# EAGLE design SparkFun Uno Qwiic Mux Shield with JST (EAGLE 7.7.0)
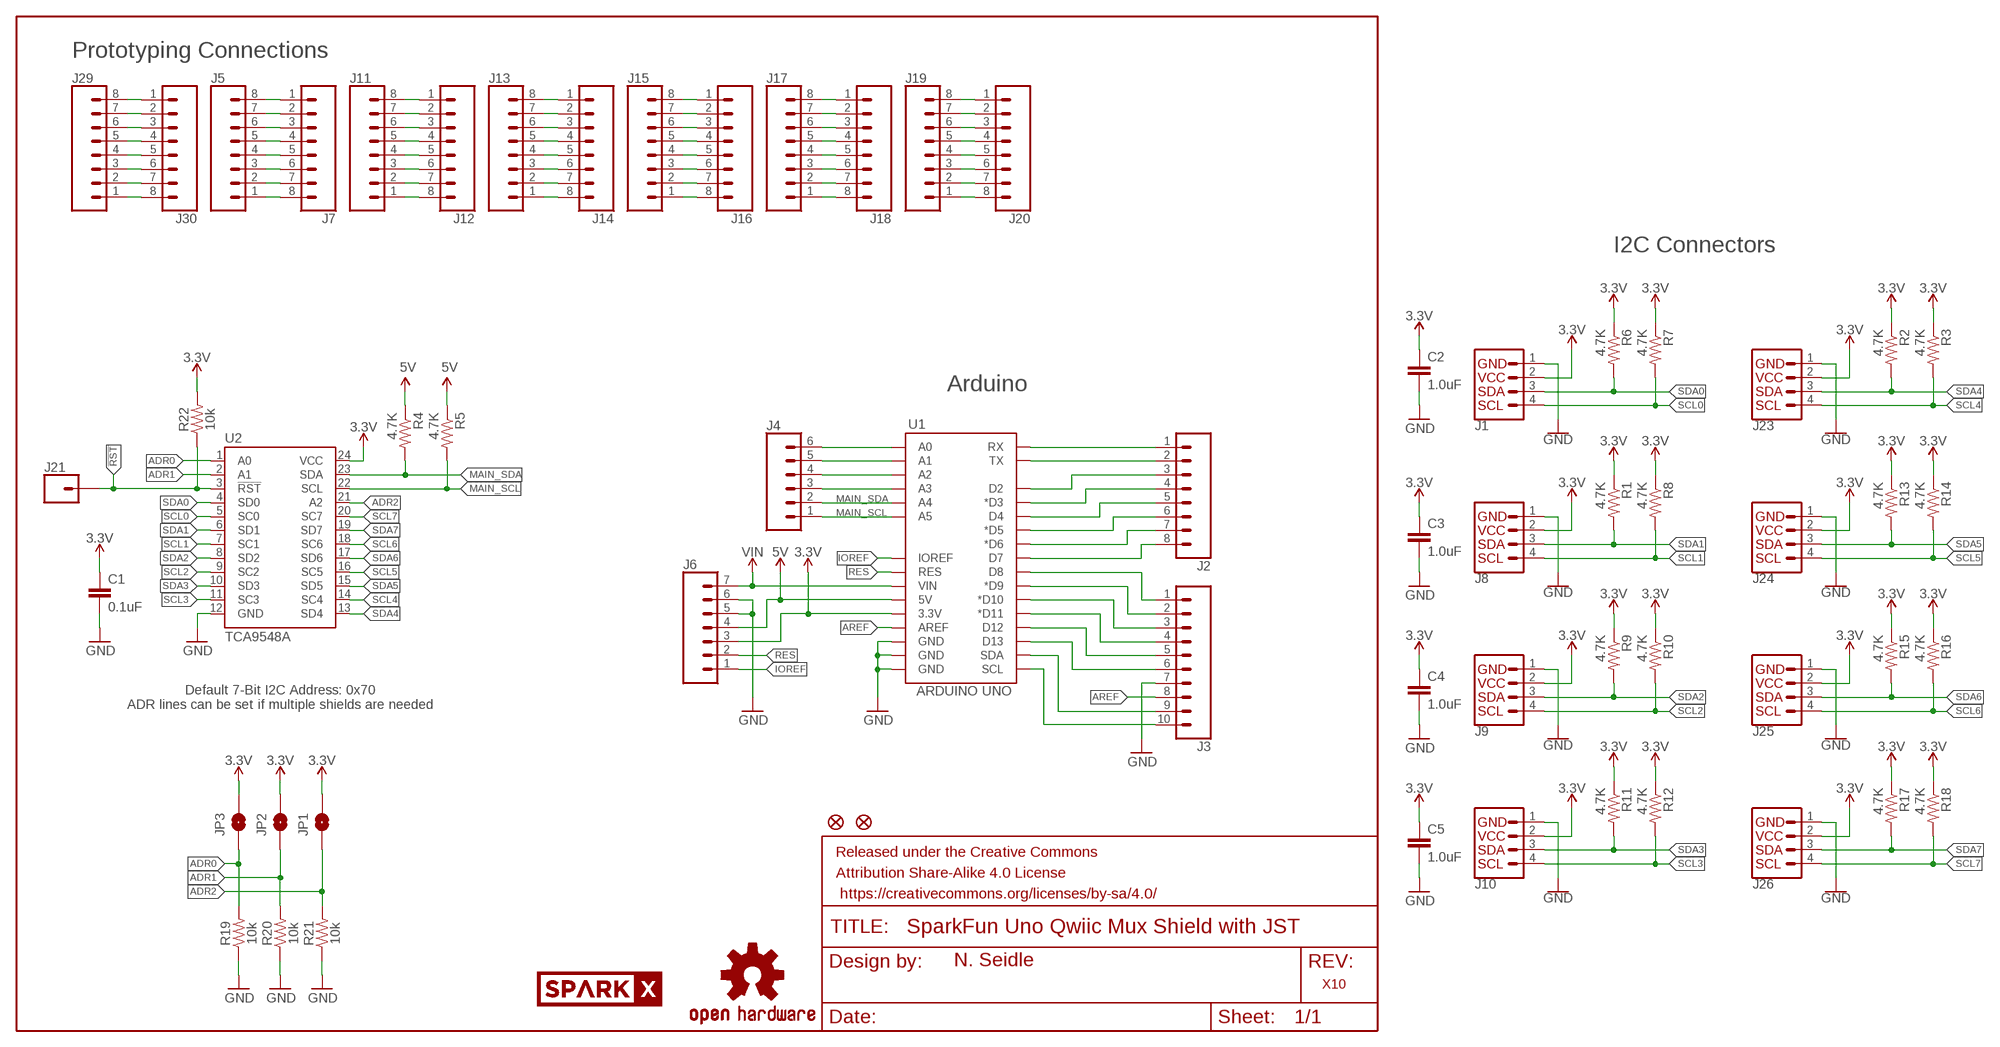
[diagram p0: schematic, sheet 1]

## Parts
C1  0.1uF  0.1UF-0603-25V-(+80/-20%)  [0603]
C2  1.0uF  1.0UF-0603-16V-10%  [0603]
C3  1.0uF  1.0UF-0603-16V-10%  [0603]
C4  1.0uF  1.0UF-0603-16V-10%  [0603]
C5  1.0uF  1.0UF-0603-16V-10%  [0603]
FD1  FIDUCIAL1X2  [FIDUCIAL-1X2]
FD2  FIDUCIAL1X2  [FIDUCIAL-1X2]
FRAME1  FRAME-LETTER  [CREATIVE_COMMONS]
J1  I2C_STANDARDJS-1MM  [1X04_1MM_RA]
J2  CONN_08NO_SILK_FEMALE_PTH  [1X08_NO_SILK]
J3  CONN_10NO_SILK_PTH_FEMALE  [1X10_NO_SILK]
J4  CONN_06NO_SILK_FEMALE_PTH  [1X06_NO_SILK]
J5  CONN_08NO_SILK_FEMALE_PTH  [1X08_NO_SILK]
J6  CONN_07NO_SILK  [1X07_NO_SILK]
J7  CONN_08NO_SILK_FEMALE_PTH  [1X08_NO_SILK]
J8  I2C_STANDARDJS-1MM  [1X04_1MM_RA]
J9  I2C_STANDARDJS-1MM  [1X04_1MM_RA]
J10  I2C_STANDARDJS-1MM  [1X04_1MM_RA]
J11  CONN_08NO_SILK_FEMALE_PTH  [1X08_NO_SILK]
J12  CONN_08NO_SILK_FEMALE_PTH  [1X08_NO_SILK]
J13  CONN_08NO_SILK_FEMALE_PTH  [1X08_NO_SILK]
J14  CONN_08NO_SILK_FEMALE_PTH  [1X08_NO_SILK]
J15  CONN_08NO_SILK_FEMALE_PTH  [1X08_NO_SILK]
J16  CONN_08NO_SILK_FEMALE_PTH  [1X08_NO_SILK]
J17  CONN_08NO_SILK_FEMALE_PTH  [1X08_NO_SILK]
J18  CONN_08NO_SILK_FEMALE_PTH  [1X08_NO_SILK]
J19  CONN_08NO_SILK_FEMALE_PTH  [1X08_NO_SILK]
J20  CONN_08NO_SILK_FEMALE_PTH  [1X08_NO_SILK]
J21  CONN_01  [1X01]
J23  I2C_STANDARDSILK  [1X04]
J24  I2C_STANDARDSILK  [1X04]
J25  I2C_STANDARDSILK  [1X04]
J26  I2C_STANDARDSILK  [1X04]
J29  CONN_08NO_SILK_FEMALE_PTH  [1X08_NO_SILK]
J30  CONN_08NO_SILK_FEMALE_PTH  [1X08_NO_SILK]
JP1  JUMPER-SMT_2_NO_SILK  [SMT-JUMPER_2_NO_SILK]
JP2  JUMPER-SMT_2_NO_SILK  [SMT-JUMPER_2_NO_SILK]
JP3  JUMPER-SMT_2_NO_SILK  [SMT-JUMPER_2_NO_SILK]
LOGO1  OSHW-LOGOMINI  [OSHW-LOGO-MINI]
R1  4.7K  4.7KOHM-1/10W-1%(0603)  [0603-RES]
R2  4.7K  4.7KOHM-1/10W-1%(0603)  [0603-RES]
R3  4.7K  4.7KOHM-1/10W-1%(0603)  [0603-RES]
R4  4.7K  4.7KOHM-1/10W-1%(0603)  [0603-RES]
R5  4.7K  4.7KOHM-1/10W-1%(0603)  [0603-RES]
R6  4.7K  4.7KOHM-1/10W-1%(0603)  [0603-RES]
R7  4.7K  4.7KOHM-1/10W-1%(0603)  [0603-RES]
R8  4.7K  4.7KOHM-1/10W-1%(0603)  [0603-RES]
R9  4.7K  4.7KOHM-1/10W-1%(0603)  [0603-RES]
R10  4.7K  4.7KOHM-1/10W-1%(0603)  [0603-RES]
R11  4.7K  4.7KOHM-1/10W-1%(0603)  [0603-RES]
R12  4.7K  4.7KOHM-1/10W-1%(0603)  [0603-RES]
R13  4.7K  4.7KOHM-1/10W-1%(0603)  [0603-RES]
R14  4.7K  4.7KOHM-1/10W-1%(0603)  [0603-RES]
R15  4.7K  4.7KOHM-1/10W-1%(0603)  [0603-RES]
R16  4.7K  4.7KOHM-1/10W-1%(0603)  [0603-RES]
R17  4.7K  4.7KOHM-1/10W-1%(0603)  [0603-RES]
R18  4.7K  4.7KOHM-1/10W-1%(0603)  [0603-RES]
R19  10k  10KOHM-0603-1/10W-1%  [0603]
R20  10k  10KOHM-0603-1/10W-1%  [0603]
R21  10k  10KOHM-0603-1/10W-1%  [0603]
R22  10k  10KOHM-0603-1/10W-1%  [0603]
U1  ARDUINO UNO  ARDUINO_R3_SHIELDNOLABELS  [UNO_R3_SHIELD_NOLABELS]
U2  TCA9548A  [TSSOP28]
U$1  SPARKX-LOGO3  [SPARKX-SMALL]
U$2  SPARKX-LOGO5  [SPARKX-LARGE]

## Nets
3.3V: C1.1 C2.1 C3.1 C4.1 C5.1 J1.2(VCC) J6.3 J8.2(VCC) J9.2(VCC) J10.2(VCC) J23.2(VCC) J24.2(VCC) J25.2(VCC) J26.2(VCC) JP1.2 JP2.2 JP3.2 R1.1 R2.1 R3.1 R6.1 R7.1 R8.1 R9.1 R10.1 R11.1 R12.1 R13.1 R14.1 R15.1 R16.1 R17.1 R18.1 R22.2 U1.3.3V U2.24(VCC)
5V: J6.4 R4.1 R5.1 U1.5V
!RST: J21.1 R22.1 U2.3(!RST)
A0: J4.6 U1.A0
A1: J4.5 U1.A1
A2: J4.4 U1.A2
A3: J4.3 U1.A3
ADR0: JP3.1 R19.2 U2.1(A0)
ADR1: JP2.1 R20.2 U2.2(A1)
ADR2: JP1.1 R21.2 U2.21(A2)
AREF: J3.8 U1.AREF
D2: J2.3 U1.D2
D3: J2.4 U1.D3(*D3)
D4: J2.5 U1.D4
D5: J2.6 U1.D5(*D5)
D6: J2.7 U1.D6(*D6)
D7: J2.8 U1.D7
D8: J3.1 U1.D8
D9: J3.2 U1.D9(*D9)
D10: J3.3 U1.D10(*D10)
D11: J3.4 U1.D11(*D11)
D12: J3.5 U1.D12
D13: J3.6 U1.D13
GND [vcc]: C1.2 C2.2 C3.2 C4.2 C5.2 J1.1(GND) J3.7 J6.5 J6.6 J8.1(GND) J9.1(GND) J10.1(GND) J23.1(GND) J24.1(GND) J25.1(GND) J26.1(GND) R19.1 R20.1 R21.1 U1.GND@0(GND) U1.GND@1(GND) U1.GND@2(GND) U2.12(GND)
IOREF: J6.1 U1.IOREF
MAIN_SCL: J4.1 R5.2 U1.A5 U2.22(SCL)
MAIN_SCL_1: J3.10 U1.SCL
MAIN_SDA: J4.2 R4.2 U1.A4 U2.23(SDA)
MAIN_SDA_1: J3.9 U1.SDA
N$1: J5.8 J7.1
N$2: J5.7 J7.2
N$3: J5.6 J7.3
N$4: J5.5 J7.4
N$5: J5.4 J7.5
N$6: J5.3 J7.6
N$7: J5.2 J7.7
N$8: J5.1 J7.8
N$9: J11.8 J12.1
N$10: J11.7 J12.2
N$11: J11.6 J12.3
N$12: J11.5 J12.4
N$13: J11.4 J12.5
N$14: J11.3 J12.6
N$15: J11.2 J12.7
N$16: J11.1 J12.8
N$17: J13.8 J14.1
N$18: J13.7 J14.2
N$19: J13.6 J14.3
N$20: J13.5 J14.4
N$21: J13.4 J14.5
N$22: J13.3 J14.6
N$23: J13.2 J14.7
N$24: J13.1 J14.8
N$25: J15.8 J16.1
N$26: J15.7 J16.2
N$27: J15.6 J16.3
N$28: J15.5 J16.4
N$29: J15.4 J16.5
N$30: J15.3 J16.6
N$31: J15.2 J16.7
N$32: J15.1 J16.8
N$33: J17.8 J18.1
N$34: J17.7 J18.2
N$35: J17.6 J18.3
N$36: J17.5 J18.4
N$37: J17.4 J18.5
N$38: J17.3 J18.6
N$39: J17.2 J18.7
N$40: J17.1 J18.8
N$41: J19.8 J20.1
N$42: J19.7 J20.2
N$43: J19.6 J20.3
N$44: J19.5 J20.4
N$45: J19.4 J20.5
N$46: J19.3 J20.6
N$47: J19.2 J20.7
N$48: J19.1 J20.8
N$57: J29.8 J30.1
N$58: J29.7 J30.2
N$59: J29.6 J30.3
N$60: J29.5 J30.4
N$61: J29.4 J30.5
N$62: J29.3 J30.6
N$63: J29.2 J30.7
N$64: J29.1 J30.8
RES: J6.2 U1.RES
RX: J2.1 U1.RX
SCL0: J1.4(SCL) R7.2 U2.5(SC0)
SCL1: J8.4(SCL) R8.2 U2.7(SC1)
SCL2: J9.4(SCL) R10.2 U2.9(SC2)
SCL3: J10.4(SCL) R12.2 U2.11(SC3)
SCL4: J23.4(SCL) R3.2 U2.14(SC4)
SCL5: J24.4(SCL) R14.2 U2.16(SC5)
SCL6: J25.4(SCL) R16.2 U2.18(SC6)
SCL7: J26.4(SCL) R18.2 U2.20(SC7)
SDA0: J1.3(SDA) R6.2 U2.4(SD0)
SDA1: J8.3(SDA) R1.2 U2.6(SD1)
SDA2: J9.3(SDA) R9.2 U2.8(SD2)
SDA3: J10.3(SDA) R11.2 U2.10(SD3)
SDA4: J23.3(SDA) R2.2 U2.13(SD4)
SDA5: J24.3(SDA) R13.2 U2.15(SD5)
SDA6: J25.3(SDA) R15.2 U2.17(SD6)
SDA7: J26.3(SDA) R17.2 U2.19(SD7)
TX: J2.2 U1.TX
VIN [vcc]: J6.7 U1.VIN

## Notes on the sheet
- Prototyping Connections
- I2C Connectors
- Arduino
- Default 7-Bit I2C Address: 0x70
  ADR lines can be set if multiple shields are needed
- N. Seidle
- X10

## Library data of the parts
C1 = SparkFun-Capacitors:0.1UF: 0.1µF ceramic capacitors A capacitor is a passive two-terminal electrical component used to store electrical energy temporarily in an electric field.; PROD_ID: CAP-00810
C2-C5 = SparkFun-Capacitors:1.0UF: 1µF ceramic capacitors A capacitor is a passive two-terminal electrical component used to store electrical energy temporarily in an electric field.; PROD_ID: CAP-00868
FD1 FD2 = SparkFun-Aesthetics:FIDUCIAL: Fiducial Alignment Points Various fiducial points for machine vision alignment.
FRAME1 = SparkFun-Aesthetics:FRAME-LETTER: Schematic Frame Standard 8.5x11 US Letter frame
J1 J8-J10 J23-J26 = SparkX:I2C_STANDARD: SparkFun I2C Standard Pinout Header SparkFun has standardized on a pinout for all I2C based sensor breakouts. This pinout allows I2C boards to be plugged directly into the headers on Arduino Uno compatible boards, and to be daisy chained easily. Example SparkFun Products: SparkFun Atmospheric Sensor Breakout - BME280 <https://www.sparkfun.com/products/13676> SparkFun Altitude/Pressure Sensor Breakout - MPL3115A2 <https://www.sparkfun.com/products/11084> SparkFun TOF Range Finder Sensor - VL6180 <https://www.sparkfun.com/products/12785>
J2 J5 J7 J11-J20 J29 J30 = SparkFun-Connectors:CONN_08: Multi connection point. Often used as Generic Header-pin footprint for 0.1 inch spaced/style header connections On any of the 0.1 inch spaced packages, you can populate with these: Break Away Headers - Straight <https://www.sparkfun.com/products/116> (PRT-00116) Break Away Male Headers - Right Angle <https://www.sparkfun.com/products/553> (PRT-00553) Female Headers <https://www.sparkfun.com/products/115> (PRT-00115) Break Away Headers - Machine Pin <https://www.sparkfun.com/products/117> (PRT-00117) Break Away Female Headers - Swiss Machine Pin <https://www.sparkfun.com/products/743> (PRT-00743) Arduino Stackable Header - 8 Pin <https://www.sparkfun.com/products/9279> (PRT-09279) For SCREWTERMINALS and SPRING TERMINALS visit here: Screw Terimnals on SparkFun.com <https://www.sparkfun.com/search/results?term=Screw+Terminals> (5mm/3.5mm/2.54mm spacing) This device is also useful as a general connection point to wire up your design to another part of your project. Our various solder wires solder well into these plated through hole pads. Hook-Up Wire - Assortment (Stranded, 22 AWG) <https://www.sparkfun.com/products/11375> (PRT-11375) Hook-Up Wire - Assortment (Solid Core, 22 AWG) <https://www.sparkfun.com/products/11367> (PRT-11367) View the entire wire category on our website here <https://www.sparkfun.com/categories/141> Special notes: Molex polarized connector foot print use with SKU : PRT-08231 with associated crimp pins and housings. 1MM SMD Version SKU: PRT-10208 NOTES ON THE VARIANTS LOCK and LOCK_LONGPADS... This footprint was designed to help hold the alignment of a through-hole component (i.e. 6-pin header) while soldering it into place. You may notice that each hole has been shifted either up or down by 0.005 of an inch from it's more standard position (which is a perfectly straight line). This slight alteration caused the pins (the squares in the middle) to touch the edges of the holes. Because they are alternating, it causes a "brace" to hold the component in place. 0.005 has proven to be the perfect amount of "off-center" position when using our standard breakaway headers. Although looks a little odd when you look at the bare footprint, once you have a header in there, the alteration is very hard to notice. Also,if you push a header all the way into place, it is covered up entirely on the bottom side.; PROD_ID: CONN-08438
J3 = SparkFun-Connectors:CONN_10: Multi connection point. Often used as Generic Header-pin footprint for 0.1 inch spaced/style header connections On any of the 0.1 inch spaced packages, you can populate with these: Break Away Headers - Straight <https://www.sparkfun.com/products/116> (PRT-00116) Break Away Male Headers - Right Angle <https://www.sparkfun.com/products/553> (PRT-00553) Female Headers <https://www.sparkfun.com/products/115> (PRT-00115) Break Away Headers - Machine Pin <https://www.sparkfun.com/products/117> (PRT-00117) Break Away Female Headers - Swiss Machine Pin <https://www.sparkfun.com/products/743> (PRT-00743) Arduino Stackable Header - 10 Pin <https://www.sparkfun.com/products/11376> (PRT-11376) For SCREWTERMINALS and SPRING TERMINALS visit here: Screw Terimnals on SparkFun.com <https://www.sparkfun.com/search/results?term=Screw+Terminals> (5mm/3.5mm/2.54mm spacing) This device is also useful as a general connection point to wire up your design to another part of your project. Our various solder wires solder well into these plated through hole pads. Hook-Up Wire - Assortment (Stranded, 22 AWG) <https://www.sparkfun.com/products/11375> (PRT-11375) Hook-Up Wire - Assortment (Solid Core, 22 AWG) <https://www.sparkfun.com/products/11367> (PRT-11367) View the entire wire category on our website here <https://www.sparkfun.com/categories/141> Special notes: Molex polarized connector foot print use with SKU : PRT-08231 with associated crimp pins and housings. 1MM SMD Version SKU: PRT-10208 NOTES ON THE VARIANTS LOCK and LOCK_LONGPADS... This footprint was designed to help hold the alignment of a through-hole component (i.e. 6-pin header) while soldering it into place. You may notice that each hole has been shifted either up or down by 0.005 of an inch from it's more standard position (which is a perfectly straight line). This slight alteration caused the pins (the squares in the middle) to touch the edges of the holes. Because they are alternating, it causes a "brace" to hold the component in place. 0.005 has proven to be the perfect amount of "off-center" position when using our standard breakaway headers. Although looks a little odd when you look at the bare footprint, once you have a header in there, the alteration is very hard to notice. Also,if you push a header all the way into place, it is covered up entirely on the bottom side.; PROD_ID: CONN-11563
J4 = SparkFun-Connectors:CONN_06: Multi connection point. Often used as Generic Header-pin footprint for 0.1 inch spaced/style header connections On any of the 0.1 inch spaced packages, you can populate with these: Break Away Headers - Straight <https://www.sparkfun.com/products/116> (PRT-00116) Break Away Male Headers - Right Angle <https://www.sparkfun.com/products/553> (PRT-00553) Female Headers <https://www.sparkfun.com/products/115> (PRT-00115) Break Away Headers - Machine Pin <https://www.sparkfun.com/products/117> (PRT-00117) Break Away Female Headers - Swiss Machine Pin <https://www.sparkfun.com/products/743> (PRT-00743) Arduino Stackable Header - 6 Pin <https://www.sparkfun.com/products/9280> (PRT-09280) For SCREWTERMINALS and SPRING TERMINALS visit here: Screw Terimnals on SparkFun.com <https://www.sparkfun.com/search/results?term=Screw+Terminals> (5mm/3.5mm/2.54mm spacing) This device is also useful as a general connection point to wire up your design to another part of your project. Our various solder wires solder well into these plated through hole pads. Hook-Up Wire - Assortment (Stranded, 22 AWG) <https://www.sparkfun.com/products/11375> (PRT-11375) Hook-Up Wire - Assortment (Solid Core, 22 AWG) <https://www.sparkfun.com/products/11367> (PRT-11367) View the entire wire category on our website here <https://www.sparkfun.com/categories/141>; PROD_ID: CONN-08437
J6 = SparkFun-Connectors:CONN_07: Multi connection point. Often used as Generic Header-pin footprint for 0.1 inch spaced/style header connections On any of the 0.1 inch spaced packages, you can populate with these: Break Away Headers - Straight <https://www.sparkfun.com/products/116> (PRT-00116) Break Away Male Headers - Right Angle <https://www.sparkfun.com/products/553> (PRT-00553) Female Headers <https://www.sparkfun.com/products/115> (PRT-00115) Break Away Headers - Machine Pin <https://www.sparkfun.com/products/117> (PRT-00117) Break Away Female Headers - Swiss Machine Pin <https://www.sparkfun.com/products/743> (PRT-00743) For SCREWTERMINALS and SPRING TERMINALS visit here: Screw Terimnals on SparkFun.com <https://www.sparkfun.com/search/results?term=Screw+Terminals> (5mm/3.5mm/2.54mm spacing) This device is also useful as a general connection point to wire up your design to another part of your project. Our various solder wires solder well into these plated through hole pads. Hook-Up Wire - Assortment (Stranded, 22 AWG) <https://www.sparkfun.com/products/11375> (PRT-11375) Hook-Up Wire - Assortment (Solid Core, 22 AWG) <https://www.sparkfun.com/products/11367> (PRT-11367) View the entire wire category on our website here <https://www.sparkfun.com/categories/141> Special notes: Molex polarized connector foot print use with SKU : PRT-08231 with associated crimp pins and housings. 1MM SMD Version SKU: PRT-10208 NOTES ON THE VARIANTS LOCK and LOCK_LONGPADS... This footprint was designed to help hold the alignment of a through-hole component (i.e. 6-pin header) while soldering it into place. You may notice that each hole has been shifted either up or down by 0.005 of an inch from it's more standard position (which is a perfectly straight line). This slight alteration caused the pins (the squares in the middle) to touch the edges of the holes. Because they are alternating, it causes a "brace" to hold the component in place. 0.005 has proven to be the perfect amount of "off-center" position when using our standard breakaway headers. Although looks a little odd when you look at the bare footprint, once you have a header in there, the alteration is very hard to notice. Also,if you push a header all the way into place, it is covered up entirely on the bottom side.
J21 = SparkFun-Connectors:CONN_01: Single connection point. Often used as Generic Header-pin footprint for 0.1 inch spaced/style header connections On any of the 0.1 inch spaced packages, you can populate with these: Break Away Headers - Straight <https://www.sparkfun.com/products/116> (PRT-00116) Break Away Male Headers - Right Angle <https://www.sparkfun.com/products/553> (PRT-00553) Female Headers <https://www.sparkfun.com/products/115> (PRT-00115) Break Away Headers - Machine Pin <https://www.sparkfun.com/products/117> (PRT-00117) Break Away Female Headers - Swiss Machine Pin <https://www.sparkfun.com/products/743> (PRT-00743) This device is also useful as a general connection point to wire up your design to another part of your project. Our various solder wires solder well into these plated through hole pads. Hook-Up Wire - Assortment (Stranded, 22 AWG) <https://www.sparkfun.com/products/11375> (PRT-11375) Hook-Up Wire - Assortment (Solid Core, 22 AWG) <https://www.sparkfun.com/products/11367> (PRT-11367) View the entire wire category on our website here <https://www.sparkfun.com/categories/141> Special notes: SMTSO-256-ET is a "flush mount" nut for a 4-40 screw. We mostly use this on specialty testbeds; it is a nice way to connect hardware to your PCB at an adjustable hieght. Also note, the SNAP packages are for using a snappable style connector. We sell a baggie of snaps and they are also used on two LilyPad designs: Snap Assortment - 30 pack (male and female) <https://www.sparkfun.com/products/11347> (DEV-11347) LilyPad Arduino SimpleSnap <https://www.sparkfun.com/products/10941> (DEV-10941) LilyPad SimpleSnap Protoboard <https://www.sparkfun.com/products/10940> (DEV-10940)
JP1-JP3 = SparkFun-Jumpers:JUMPER-SMT_2_NO: Normally open jumper This jumper has two pads in close proximity to each other. Apply solder to close the connection. Round pads are easier to solder for beginners, but are a lot larger. SparkFun Product that uses the round pads: SparkFun EL Sequencer <https://www.sparkfun.com/products/12781>
LOGO1 = SparkFun-Aesthetics:OSHW-LOGO: Open Source Hardware Logo This logo indicates the piece of hardware it is found on incorporates a OSHW license and/or adheres to the definition of open source hardware found here: http://freedomdefined.org/OSHW
R1-R18 = SparkFun-Resistors:4.7KOHM-1/10W-1%(0603): RES-07857; PROD_ID: RES-07857
R19-R22 = SparkFun-Resistors:10KOHM: 10kΩ resistor A resistor is a passive two-terminal electrical component that implements electrical resistance as a circuit element. Resistors act to reduce current flow, and, at the same time, act to lower voltage levels within circuits. - Wikipedia; PROD_ID: RES-00824
U1 = SparkFun-Boards:ARDUINO_R3_SHIELD: Shield form compatible with the Arduino Uno R3.
U2 = SparkX:TCA9548A
U$1 U$2 = SparkX:SPARKX-LOGO

## Net classes
0 Default: width 0.178 mm
1 vcc: width 0.178 mm

## Board
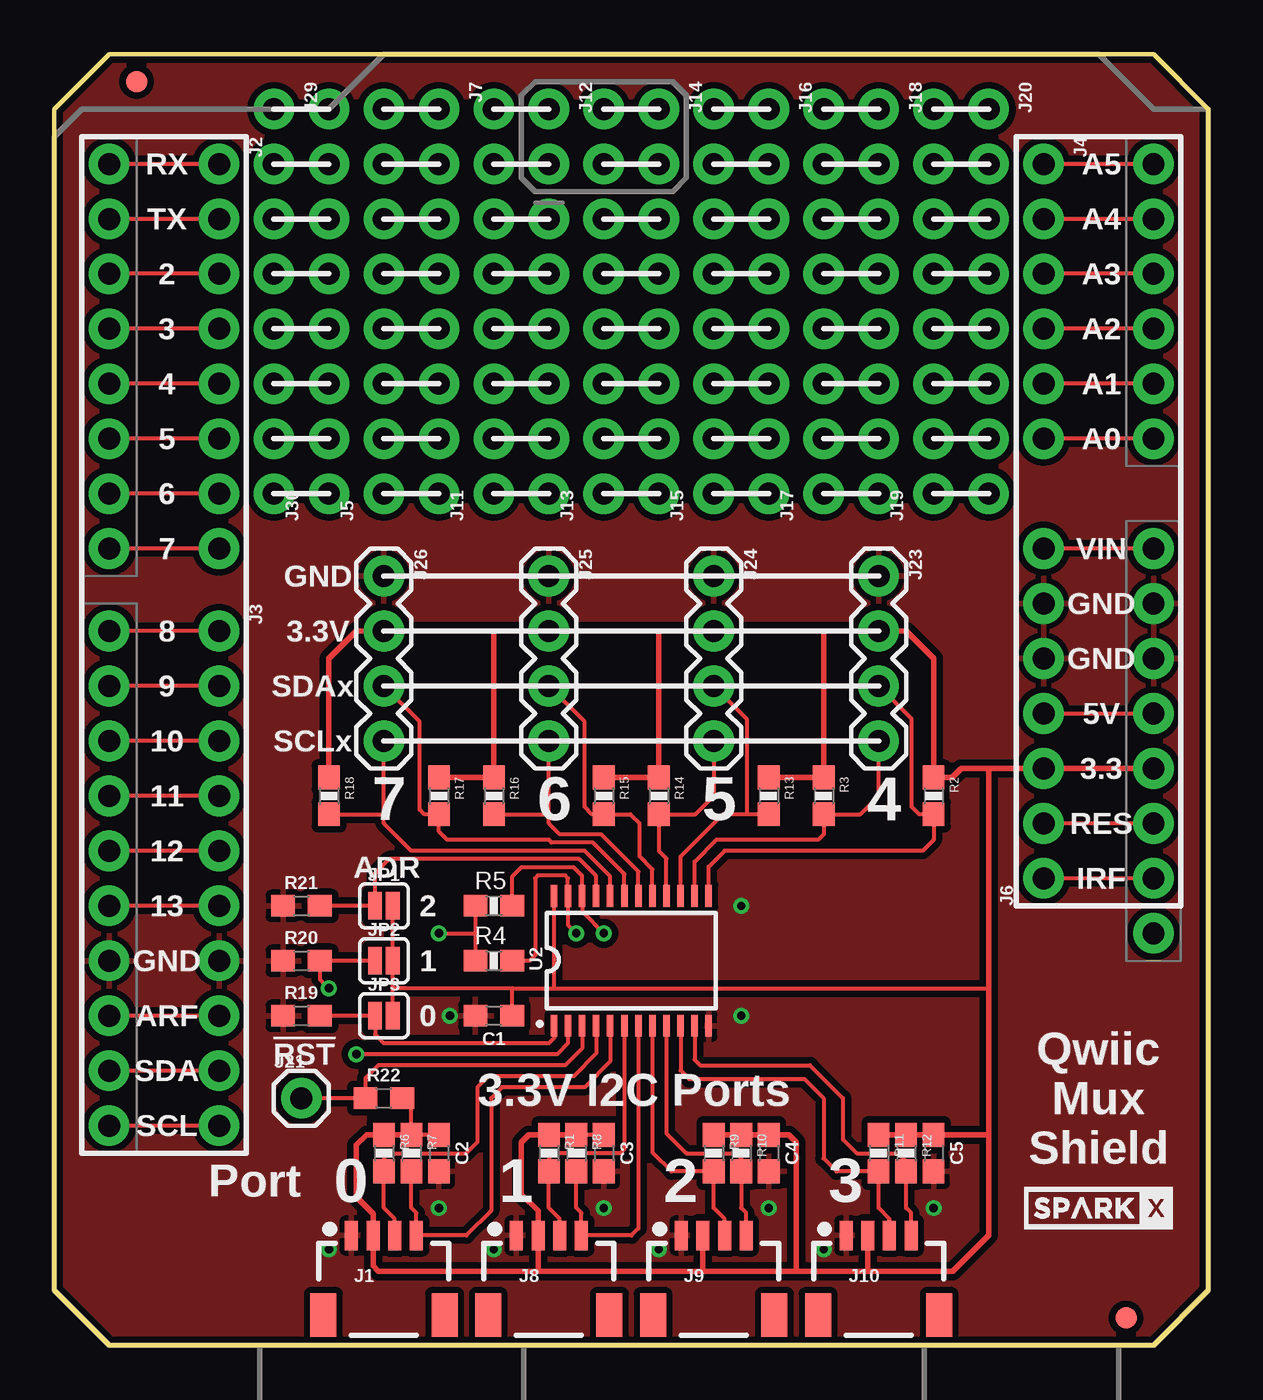
[diagram p1: board, top side]
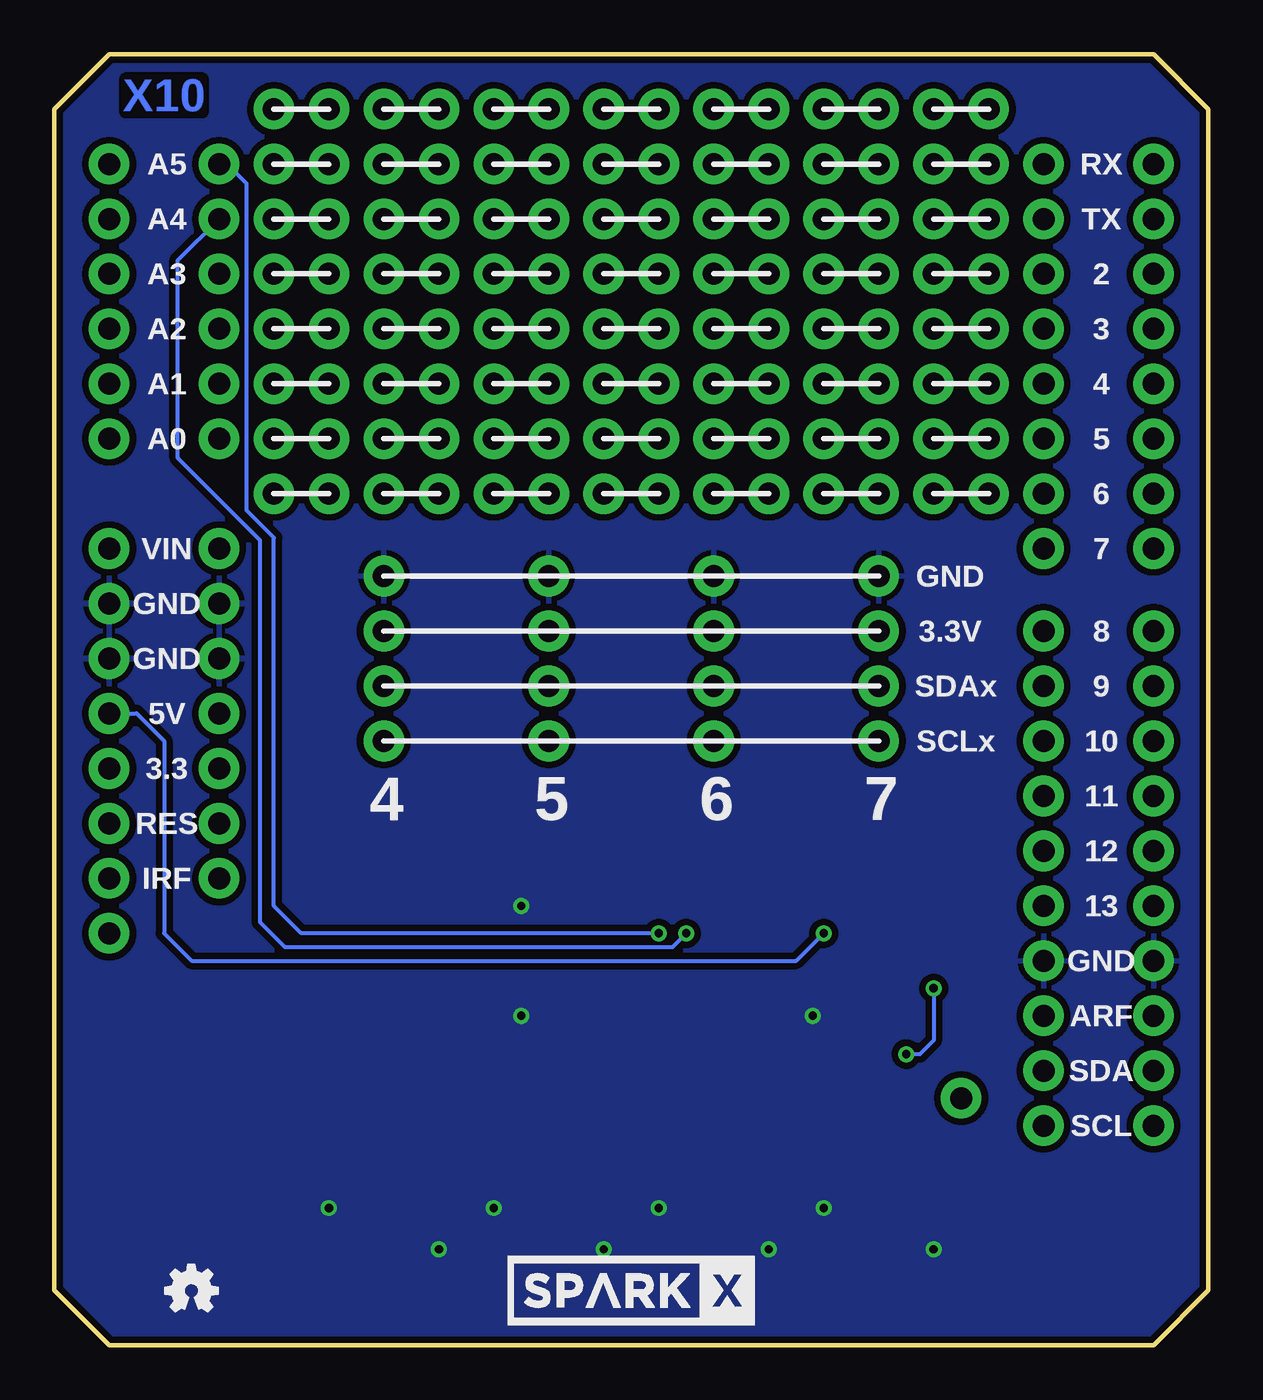
[diagram p2: board, bottom side, seen from below]

Size 53.34 x 59.69 mm. Coordinates in mm from the lower left corner, seen from the top.
Outline: 53.34,2.54 53.34,57.15 50.8,59.69 2.54,59.69 0,57.15 0,2.54 2.54,0 50.8,0 53.34,2.54
Copper layers (1*16): Top 0.035mm / dielectric 1.5mm / Bottom 0.035mm
Design rules "SparkFun-2-layer-TIGHT *": minimum track width 7mil, minimum drill 15mil, track to track 6mil, track to pad 6mil, pad to pad 6mil, via to via 6mil, smd to smd 6mil, copper to edge 7mil, drill to drill 7mil, minimum pad ring 7mil, minimum via ring 7mil, stop-mask expansion 4mil, vias tented up to drill 25mil, thermal gap 10mil

### Footprints (pad centres in the part's own frame; a part is rotated, then mirrored left to right if it is on the bottom)
0603 = smd 1.1 x 1: 1 -0.85,0; 2 0.85,0
FIDUCIAL-1X2 = smd 1 x 1: 1 0,0
1X04_1MM_RA = smd 0.6 x 1.35: 1 -1.5,0; 2 -0.5,0; 3 0.5,0; 4 1.5,0 | smd 1.2 x 2: NC1 2.8,-3.675; NC2 -2.8,-3.675
1X08_NO_SILK = drill 1.016 pad 1.88: 1 0,0; 2 2.54,0; 3 5.08,0; 4 7.62,0; 5 10.16,0; 6 12.7,0; 7 15.24,0; 8 17.78,0
1X10_NO_SILK = drill 1.016 pad 1.88: 1 0,0; 2 2.54,0; 3 5.08,0; 4 7.62,0; 5 10.16,0; 6 12.7,0; 7 15.24,0; 8 17.78,0; 9 20.32,0; 10 22.86,0
1X06_NO_SILK = drill 1.016 pad 1.88: 1 0,0; 2 2.54,0; 3 5.08,0; 4 7.62,0; 5 10.16,0; 6 12.7,0
1X07_NO_SILK = drill 1.016 pad 1.88: 1 0,0; 2 2.54,0; 3 5.08,0; 4 7.62,0; 5 10.16,0; 6 12.7,0; 7 15.24,0
1X01 = drill 1.016 pad 1.88: 1 0,0
1X04 = drill 1.016 pad 1.88: 1 0,0; 2 2.54,0; 3 5.08,0; 4 7.62,0
SMT-JUMPER_2_NO_SILK = smd 0.635 x 1.27: 1 -0.406,0; 2 0.406,0
0603-RES = smd 1.1 x 1: 1 -0.85,0; 2 0.85,0
UNO_R3_SHIELD_NOLABELS = drill 1.016 pad 1.88: 3.3V 50.8,26.67; 5V 50.8,29.21; A0 50.8,41.91; A1 50.8,44.45; A2 50.8,46.99; A3 50.8,49.53; A4 50.8,52.07; A5 50.8,54.61; AREF 2.54,15.24; D2 2.54,49.53; D3 2.54,46.99; D4 2.54,44.45; D5 2.54,41.91; D6 2.54,39.37; D7 2.54,36.83; D8 2.54,33.02; D9 2.54,30.48; D10 2.54,27.94; D11 2.54,25.4; D12 2.54,22.86; D13 2.54,20.32; GND@0 50.8,31.75; GND@1 50.8,34.29; GND@2 2.54,17.78; IOREF 50.8,21.59; NC 50.8,19.05; RES 50.8,24.13; RX 2.54,54.61; SCL 2.54,10.16; SDA 2.54,12.7; TX 2.54,52.07; VIN 50.8,36.83
TSSOP28 = smd 1 x 0.3: 1 -3,3.57; 2 -3,2.925; 3 -3,2.275; 4 -3,1.625; 5 -3,0.975; 6 -3,0.325; 7 -3,-0.325; 8 -3,-0.975; 9 -3,-1.625; 10 -3,-2.275; 11 -3,-2.925; 12 -3,-3.575; 13 3,-3.575; 14 3,-2.925; 15 3,-2.275; 16 3,-1.625; 17 3,-0.975; 18 3,-0.325; 19 3,0.325; 20 3,0.975; 21 3,1.625; 22 3,2.275; 23 3,2.925; 24 3,3.575

### Placement (x,y rotation side)
C1  20.32,15.24 180 top
C2  17.78,8.89 270 top
C3  25.4,8.89 270 top
C4  33.02,8.89 270 top
C5  40.64,8.89 270 top
FD1  49.53,1.27 0 top
FD2  3.81,58.42 0 top
FRAME1  -8.89,-24.13 0 top  (outside the outline)
J1  15.24,5.08 0 top
J2  7.62,54.61 270 top
J3  7.62,33.02 270 top
J4  45.72,54.61 270 top
J5  15.24,39.37 90 top
J6  45.72,21.59 90 top
J7  17.78,57.15 270 top
J8  22.86,5.08 0 top
J9  30.48,5.08 0 top
J10  38.1,5.08 0 top
J11  20.32,39.37 90 top
J12  22.86,57.15 270 top
J13  25.4,39.37 90 top
J14  27.94,57.15 270 top
J15  30.48,39.37 90 top
J16  33.02,57.15 270 top
J17  35.56,39.37 90 top
J18  38.1,57.15 270 top
J19  40.64,39.37 90 top
J20  43.18,57.15 270 top
J21  11.43,11.43 0 top
J23  38.1,35.56 270 top
J24  30.48,35.56 270 top
J25  22.86,35.56 270 top
J26  15.24,35.56 270 top
J29  10.16,57.15 270 top
J30  12.7,39.37 90 top
JP1  15.24,20.32 0 top
JP2  15.24,17.78 0 top
JP3  15.24,15.24 0 top
LOGO1  46.99,2.54 0 bottom
R1  22.86,8.89 270 top
R2  40.64,25.4 270 top
R3  35.56,25.4 270 top
R4  20.32,17.78 0 top
R5  20.32,20.32 0 top
R6  15.24,8.89 270 top
R7  16.51,8.89 270 top
R8  24.13,8.89 270 top
R9  30.48,8.89 270 top
R10  31.75,8.89 270 top
R11  38.1,8.89 270 top
R12  39.37,8.89 270 top
R13  33.02,25.4 270 top
R14  27.94,25.4 270 top
R15  25.4,25.4 270 top
R16  20.32,25.4 270 top
R17  17.78,25.4 270 top
R18  12.7,25.4 270 top
R19  11.43,15.24 0 top
R20  11.43,17.78 0 top
R21  11.43,20.32 0 top
R22  15.24,11.43 0 top
U1  0,0 0 top
U2  26.67,17.78 90 top
U$1  48.26,6.35 0 top
U$2  26.67,2.54 0 bottom

### Tracks (layer width: path | path; a pad name or v marks a point on that pad's centre or on a via)
3.3V
  Top 0.178: JP3.2 15.65,16.51 | 15.65,16.51 JP2.2 JP1.2 | C1.1 21.17,16.47 21.21,16.51 | 21.21,16.51 15.65,16.51 | C3.1 R8.1 | C2.1 R7.1 16.51,11.01 R22.2 | U2.24 23.09,16.53 23.11,16.51 | 21.21,16.51 23.11,16.51 | 23.11,16.51 43.18,16.51
  Top 0.254: 22.35,3.43 14.99,3.43 14.74,3.67 J1.2 14.74,6.09 13.97,6.86 13.97,9.27 14.44,9.74 R6.1 R7.1 | 22.35,3.43 29.97,3.43 | 29.97,3.43 34.29,3.43 | 34.29,3.43 37.59,3.43 | 37.59,3.43 41.53,3.43 43.18,5.08 43.18,9.78 | 43.18,9.78 43.18,16.51 43.18,26.67 | J10.2 37.6,3.44 37.59,3.43 | J9.2 29.98,3.44 29.97,3.43 | 22.35,3.43 22.36,3.44 J8.2 22.36,6.21 21.59,6.99 21.59,9.4 21.93,9.74 R1.1 R8.1 | U1.3.3V J6.3 43.18,26.67 | 43.18,26.67 41.91,26.67 41.49,26.25 R2.1 40.64,31.75 39.37,33.02 J23.2 35.56,33.02 | 35.56,33.02 J24.2 27.94,33.02 | 27.94,33.02 J25.2 20.32,33.02 | 20.32,33.02 J26.2 13.97,33.02 12.7,31.75 R18.1 | 35.56,33.02 R3.1 R13.1 | R15.1 R14.1 27.94,33.02 | R17.1 R16.1 20.32,33.02 | 43.18,9.78 43.14,9.74 C5.1 R12.1 R11.1 | 34.29,3.43 34.29,9.4 33.95,9.74 C4.1 R10.1 R9.1
5V  (via drill 0.38)
  Top 0.178: R5.1 19.47,19.05 | 19.47,19.05 R4.1 | v17.78,19.05 19.47,19.05 | J6.4 U1.5V
  Bottom 0.178: U1.5V 49.53,29.21 48.26,27.94 48.26,19.05 46.99,17.78 19.05,17.78 v17.78,19.05
!RST
  Top 0.178: U2.3 24.39,13.73 23.62,12.95 14.99,12.95 14.39,12.36 R22.1 J21.1
A0
  Top 0.178: U1.A0 J4.6
A1
  Top 0.178: U1.A1 J4.5
A2
  Top 0.178: U1.A2 J4.4
A3
  Top 0.178: U1.A3 J4.3
ADR0
  Top 0.178: R19.2 JP3.1 14.83,14.38 15.24,13.97 22.86,13.97 23.1,14.21 U2.1
ADR1  (via drill 0.38)
  Top 0.178: JP2.1 R20.2 12.28,16.93 v12.7,16.51 | U2.2 23.75,13.97 23.24,13.46 v13.97,13.46
  Bottom 0.178: v12.7,16.51 12.7,14.1 13.34,13.46 v13.97,13.46
ADR2
  Top 0.178: U2.21 25.05,21.69 24.26,22.48 15.49,22.48 14.83,21.82 JP1.1 R21.2
AREF
  Top 0.178: J3.8 U1.AREF
D2
  Top 0.178: J2.3 U1.D2
D3
  Top 0.178: J2.4 U1.D3
D4
  Top 0.178: J2.5 U1.D4
D5
  Top 0.178: J2.6 U1.D5
D6
  Top 0.178: J2.7 U1.D6
D7
  Top 0.178: J2.8 U1.D7
D8
  Top 0.178: J3.1 U1.D8
D9
  Top 0.178: J3.2 U1.D9
D10
  Top 0.178: J3.3 U1.D10
D11
  Top 0.178: J3.4 U1.D11
D12
  Top 0.178: J3.5 U1.D12
D13
  Top 0.178: J3.6 U1.D13
GND  (via drill 0.38)
  other vias: 17.78,6.35 25.4,6.35 33.02,6.35 40.64,6.35 18.29,15.24 31.75,15.24 20.32,4.45 12.7,4.45 27.94,4.45 35.56,4.45 31.75,20.32
  pour Top (isolate 0.305): 53.34,0 0,0 0,59.69 53.34,59.69
  pour Bottom (isolate 0.305): 53.34,0 0,0 0,59.69 53.34,59.69
IOREF
  Top 0.178: U1.IOREF J6.1
MAIN_SCL  (via drill 0.38)
  Top 0.178: R5.2 21.17,21.68 21.59,22.1 24,22.1 24.39,21.71 U2.22 24.39,20.05 v25.4,19.05 | U1.A5 J4.1
  Bottom 0.178: v25.4,19.05 41.91,19.05 43.18,20.32 43.18,37.34 44.45,38.61 44.45,53.72 45.34,54.61 J4.1
MAIN_SCL_1
  Top 0.178: J3.10 U1.SCL
MAIN_SDA  (via drill 0.38)
  Top 0.178: R4.2 21.97,17.78 22.23,18.03 22.23,21.59 22.35,21.72 23.62,21.72 23.75,21.59 U2.23 23.75,19.43 v24.13,19.05 | U1.A4 J4.2
  Bottom 0.178: v24.13,19.05 24.77,18.41 42.67,18.41 43.81,19.56 43.81,37.21 47.62,41.02 47.62,50.16 J4.2
MAIN_SDA_1
  Top 0.178: J3.9 U1.SDA
N$1
  Top 0.178: J7.1 J5.8
N$2
  Top 0.178: J5.7 J7.2
N$3
  Top 0.178: J7.3 J5.6
N$4
  Top 0.178: J5.5 J7.4
N$5
  Top 0.178: J7.5 J5.4
N$6
  Top 0.178: J5.3 J7.6
N$7
  Top 0.178: J7.7 J5.2
N$8
  Top 0.178: J5.1 J7.8
N$9
  Top 0.178: J11.8 J12.1
N$10
  Top 0.178: J12.2 J11.7
N$11
  Top 0.178: J11.6 J12.3
N$12
  Top 0.178: J12.4 J11.5
N$13
  Top 0.178: J11.4 J12.5
N$14
  Top 0.178: J12.6 J11.3
N$15
  Top 0.178: J11.2 J12.7
N$16
  Top 0.178: J12.8 J11.1
N$17
  Top 0.178: J14.1 J13.8
N$18
  Top 0.178: J13.7 J14.2
N$19
  Top 0.178: J14.3 J13.6
N$20
  Top 0.178: J13.5 J14.4
N$21
  Top 0.178: J14.5 J13.4
N$22
  Top 0.178: J13.3 J14.6
N$23
  Top 0.178: J14.7 J13.2
N$24
  Top 0.178: J13.1 J14.8
N$25
  Top 0.178: J15.8 J16.1
N$26
  Top 0.178: J16.2 J15.7
N$27
  Top 0.178: J15.6 J16.3
N$28
  Top 0.178: J16.4 J15.5
N$29
  Top 0.178: J15.4 J16.5
N$30
  Top 0.178: J16.6 J15.3
N$31
  Top 0.178: J15.2 J16.7
N$32
  Top 0.178: J16.8 J15.1
N$33
  Top 0.178: J18.1 J17.8
N$34
  Top 0.178: J17.7 J18.2
N$35
  Top 0.178: J18.3 J17.6
N$36
  Top 0.178: J17.5 J18.4
N$37
  Top 0.178: J18.5 J17.4
N$38
  Top 0.178: J17.3 J18.6
N$39
  Top 0.178: J18.7 J17.2
N$40
  Top 0.178: J17.1 J18.8
N$41
  Top 0.178: J19.8 J20.1
N$42
  Top 0.178: J20.2 J19.7
N$43
  Top 0.178: J19.6 J20.3
N$44
  Top 0.178: J20.4 J19.5
N$45
  Top 0.178: J19.4 J20.5
N$46
  Top 0.178: J20.6 J19.3
N$47
  Top 0.178: J19.2 J20.7
N$48
  Top 0.178: J19.1 J20.8
N$57
  Top 0.178: J30.1 J29.8
N$58
  Top 0.178: J29.7 J30.2
N$59
  Top 0.178: J30.3 J29.6
N$60
  Top 0.178: J29.5 J30.4
N$61
  Top 0.178: J30.5 J29.4
N$62
  Top 0.178: J29.3 J30.6
N$63
  Top 0.178: J30.7 J29.2
N$64
  Top 0.178: J29.1 J30.8
RES
  Top 0.178: U1.RES J6.2
RX
  Top 0.178: J2.1 U1.RX
SCL0
  Top 0.178: U2.5 25.7,13.12 24.51,11.94 20.7,11.94 20.19,11.43 20.19,6.22 19.05,5.08 J1.4 16.74,6.12 16.51,6.35 R7.2
SCL1
  Top 0.178: U2.7 27,5.41 26.67,5.08 J8.4 24.36,6.12 24.13,6.35 R8.2
SCL2
  Top 0.178: U2.9 28.3,9.8 29.21,8.89 31.5,8.89 31.75,8.64 R10.2 31.75,6.35 31.98,6.12 J9.4
SCL3
  Top 0.178: U2.11 29.59,13.2 29.84,12.95 34.92,12.95 36.45,11.43 36.45,9.53 37.08,8.89 38.99,8.89 39.37,8.51 R12.2 39.37,6.35 39.6,6.12 J10.4
SCL4
  Top 0.178: U2.14 29.59,22.36 30.61,23.37 35.31,23.37 35.56,23.62 R3.2 37.25,24.55 38.1,25.4 J23.4
SCL5
  Top 0.178: J24.4 30.48,25.4 29.63,24.55 R14.2 27.94,22.86 28.3,22.5 U2.16
SCL6
  Top 0.178: U2.18 27,21.9 25.27,23.62 23.37,23.62 22.86,24.13 22.86,24.51 | 22.86,24.51 J25.4 | R16.2 22.82,24.55 22.86,24.51
SCL7
  Top 0.178: U2.20 25.7,21.68 24.51,22.86 16.51,22.86 15.24,24.13 15.24,24.51 | 15.24,24.51 J26.4 | R18.2 15.2,24.55 15.24,24.51
SDA0
  Top 0.178: U2.4 25.05,13.49 24,12.45 20.07,12.45 19.56,11.94 19.56,9.4 19.05,8.89 15.49,8.89 15.24,8.64 R6.2 15.24,6.35 15.74,5.85 J1.3
SDA1
  Top 0.178: J8.3 23.36,5.85 22.86,6.35 R1.2 22.86,8.64 23.11,8.89 26.16,8.89 26.34,9.07 U2.6
SDA2
  Top 0.178: U2.8 27.64,8.93 28.54,8.04 R9.2 30.48,6.35 30.98,5.85 J9.3
SDA3
  Top 0.178: U2.10 28.95,12.71 29.34,12.32 34.67,12.32 35.56,11.43 35.56,8.64 36.16,8.04 R11.2 38.1,6.35 38.6,5.85 J10.3
SDA4
  Top 0.178: U2.13 30.25,22.12 30.99,22.86 40.13,22.86 40.64,23.37 R2.2 39.97,24.55 39.62,24.89 39.62,28.96 J23.3
SDA5
  Top 0.178: J24.3 32,28.96 32,24.55 | U2.15 28.95,22.59 30.9,24.55 32,24.55 | R13.2 32,24.55
SDA6
  Top 0.178: U2.17 27.64,22.01 27.05,22.61 27.05,24.13 26.63,24.55 R15.2 24.85,24.55 24.51,24.89 24.51,28.83 J25.3
SDA7
  Top 0.178: U2.19 26.34,21.79 24.89,23.24 22.99,23.24 22.86,23.37 18.16,23.37 17.78,23.75 R17.2 17.11,24.55 16.89,24.77 16.89,28.83 J26.3
TX
  Top 0.178: J2.2 U1.TX
VIN
  Top 0.178: U1.VIN J6.7

### Text on the board
Bottom: X10
tPlace: RX | A5 | TX | A4 | 2 | A3 | 3 | A2 | 4 | A1 | 5 | A0 | 6 | 7 | VIN | GND | GND | 8 | 3.3V | GND | 9 | SDAx | 5V | 10 | SCLx | 3.3 | 11 | 7 | 6 | 5 | 4 | RES | 12 | ADR | IRF | 13 | 2 | GND | 1 | ARF | 0 | SDA | !RST | 3.3V I2C Ports | Qwiic / Mux / Shield | SCL | Port | 0 | 1 | 2 | 3
bPlace: RX | A5 | TX | A4 | 2 | A3 | 3 | A2 | 4 | A1 | 5 | A0 | 6 | 7 | VIN | GND | GND | 8 | 3.3V | GND | 9 | SDAx | 5V | 10 | SCLx | 3.3 | 11 | 7 | 6 | 5 | 4 | RES | 12 | IRF | 13 | GND | ARF | SDA | SCL
tDocu: N. Seidle